# EAGLE schematic TaskManager (EAGLE 9.6.2)
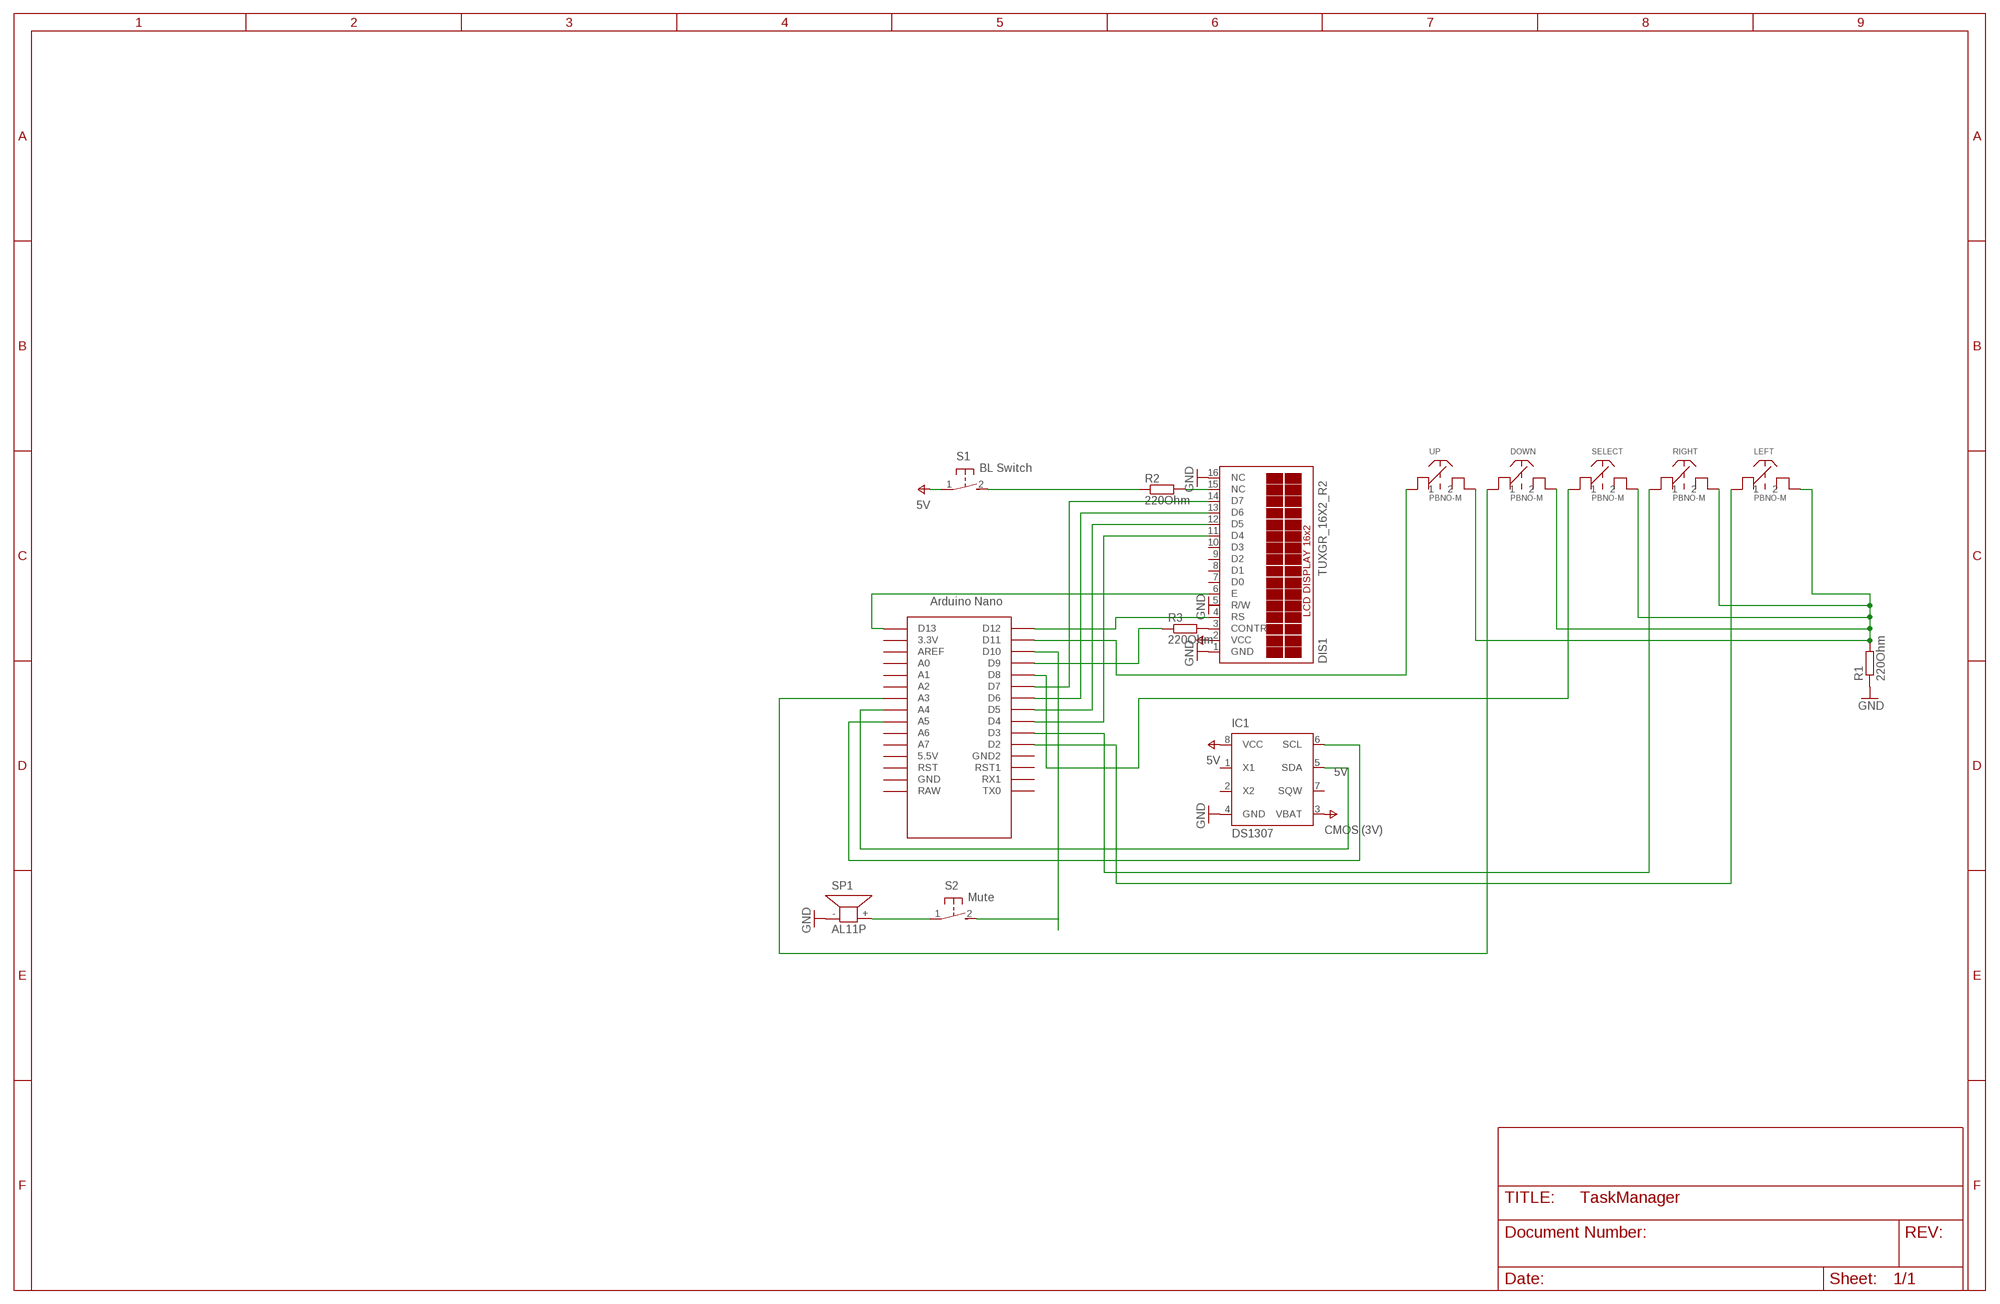
[diagram p0: schematic, sheet 1]

## Parts
DIS1  TUXGR_16X2_R2  [TUXGR_16X2_R2]
DOWN  PBNO-M  [PBNO-M]
IC1  DS1307  [DIL08]
LEFT  PBNO-M  [PBNO-M]
R1  220Ohm  R-EU_0204/2V  [0204V]
R2  220Ohm  R-EU_0204/2V  [0204V]
R3  220Ohm  R-EU_0204/2V  [0204V]
RIGHT  PBNO-M  [PBNO-M]
S1  BL Switch  31-XX  [B3F-31XX]
S2  Mute  31-XX  [B3F-31XX]
SELECT  PBNO-M  [PBNO-M]
SP1  AL11P  [AL11P]
U$1  NANO  [NANO]
UP  PBNO-M  [PBNO-M]

## Nets
GND: DIS1.1(GND) DIS1.16(NC) IC1.4(GND) R1.1 SP1.-
N$1: R3.1 U$1.D9
N$2: DIS1.4(RS) U$1.D12
N$3: DIS1.11(D4) U$1.D4
N$4: DIS1.12(D5) U$1.D5
N$5: DIS1.13(D6) U$1.D6
N$6: DIS1.14(D7) U$1.D7
N$7: DIS1.15(NC) R2.2
N$8: IC1.5(SDA) U$1.A4
N$9: IC1.6(SCL) U$1.A5
N$10: U$1.D11 UP.P$1
N$11: U$1.D10
N$12: DOWN.P$1 U$1.A3
N$13: SELECT.P$1 U$1.D8
N$14: RIGHT.P$1 U$1.D3
N$15: LEFT.P$1 U$1.D2
N$16: DIS1.6(E) U$1.D13
N$17: DOWN.P$2 LEFT.P$2 R1.2 RIGHT.P$2 SELECT.P$2 UP.P$2
N$18: DIS1.3(CONTR) R3.2
N$20: S2.1(P) SP1.+
N$21: S2.2(S)
N$22: R2.1 S1.2(S)
V+: DIS1.2(VCC) IC1.3(VBAT) IC1.8(VCC) S1.1(P) ; supply symbol labelled 5V, CMOS (3V)
Unconnected: DIS1.5(R/W) DIS1.7(D0) DIS1.8(D1) DIS1.9(D2) DIS1.10(D3) IC1.1(X1) IC1.2(X2) IC1.7(SQW) U$1.3.3V U$1.5V(5.5V) U$1.A0 U$1.A1 U$1.A2 U$1.A6 U$1.A7 U$1.AREF U$1.GND U$1.GND1(GND2) U$1.ICSP1 U$1.ICSP2 U$1.ICSP3 U$1.ICSP4 U$1.ICSP5 U$1.ICSP6 U$1.RAW U$1.RST U$1.RST1 U$1.RX1 U$1.TX0

## Library data of the parts
DIS1 = display-lcd:TUXGR_16X2_R2: Tuxgraphics LCD display 16x2 characters reflective, without background light Source: tuxgr_12x2_r2.pdf; OC_FARNELL: unknown; OC_NEWARK: unknown
DOWN LEFT RIGHT SELECT UP = pbno_m:PBNO-M
IC1 = ds1307_pcf8583:DS1307: I2C-Bus CLOCK/CALENDAR
R1-R3 = rcl:R-EU_: RESISTOR, European symbol; SPICEPREFIX: R
S1 S2 = switch-omron:31-XX: OMRON SWITCH; MPN: B3F-3100; OC_FARNELL: 959704; OC_NEWARK: 36M3582
SP1 = buzzer:AL11P: SPEAKER Source: Buerklin; OC_FARNELL: unknown; OC_NEWARK: unknown
U$1 = Arduino-clone:NANO: Arduino Nano